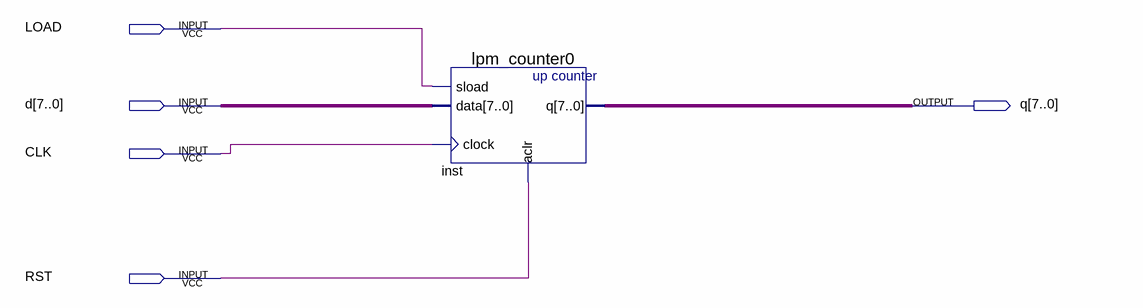
[diagram p0: schematic sheet]
// Quartus schematic PC.bdf as structural Verilog: 1 symbols, 5 pins
module PC (
  input  LOAD,
  input  [7:0] d,
  input  CLK,
  input  RST,
  output [7:0] q
);

  lpm_counter0 inst (.sload(LOAD), .data(d), .clock(CLK), .aclr(RST), .q(q));
endmodule
